# Altium project PCB_Project1.PrjPCB
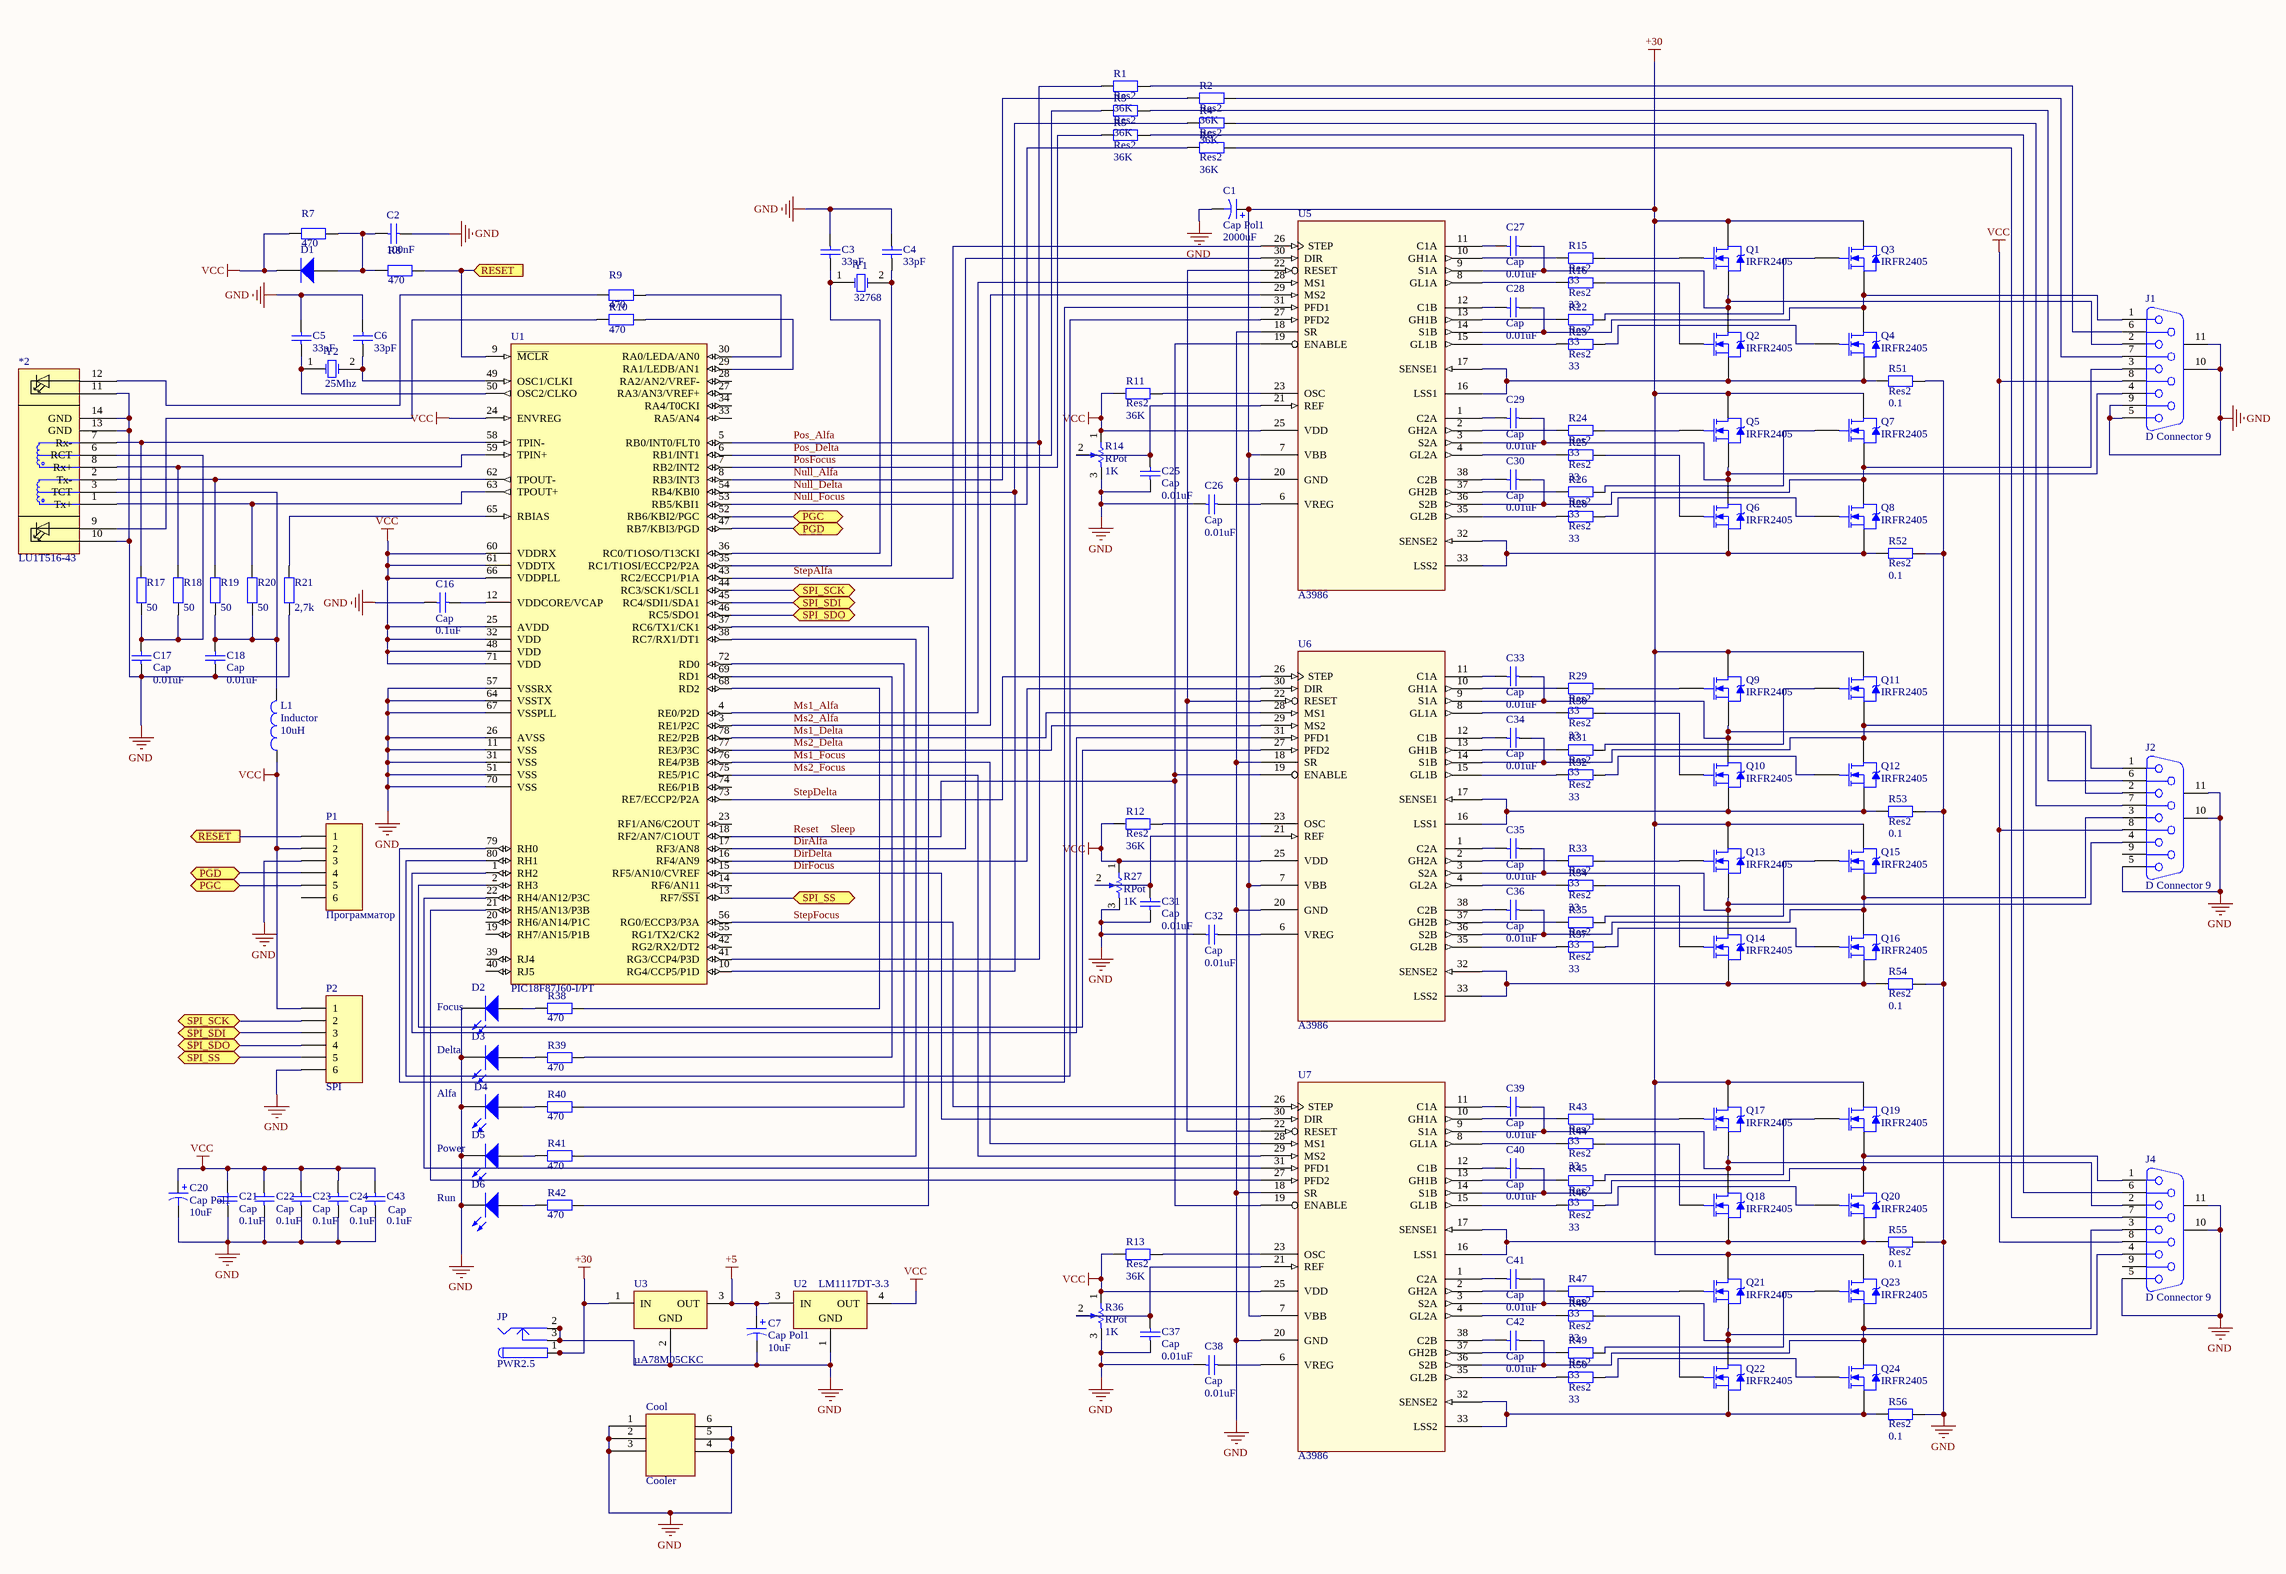
[diagram p0: Sheet1.SchDoc]
1 sheet, 137 parts. Net scope: flat (ports and power ports of the same name join across sheets).
Board file: PCB2.PcbDoc

## Sheet Sheet1.SchDoc
size A2

### Parts
*2  LU1T516-43  [EthernetCON]
C1  Cap Pol1  value 2000uF  [RB7.6-15]
C2  value 100nF  [CAPC3225N]  (hidden comment: Cap)
C3  value 33pF  [CAPC2012L]  (hidden comment: Cap)
C4  value 33pF  [CAPC2012L]  (hidden comment: Cap)
C5  value 33pF  [CAPC2012L]  (hidden comment: Cap)
C6  value 33pF  [CAPC2012L]  (hidden comment: Cap)
C7  Cap Pol1  value 10uF  [CAPPR5-5x5]
C16  Cap  value 0.1uF  [CAPC3225L]
C17  Cap  value 0.01uF  [CAPC3216L]
C18  Cap  value 0.01uF  [CAPC3216L]
C20  Cap Pol1  value 10uF  [CAPPR5-5x5]
C21  Cap  value 0.1uF  [CAPC3225L]
C22  Cap  value 0.1uF  [CAPC3225L]
C23  Cap  value 0.1uF  [CAPC3225L]
C24  Cap  value 0.1uF  [CAPC3225L]
C25  Cap  value 0.01uF  [CAPC2012L]
C26  Cap  value 0.01uF  [CAPC2012L]
C27  Cap  value 0.01uF  [CAPC2012L]
C28  Cap  value 0.01uF  [CAPC2012L]
C29  Cap  value 0.01uF  [CAPC2012L]
C30  Cap  value 0.01uF  [CAPC2012L]
C31  Cap  value 0.01uF  [CAPC2012L]
C32  Cap  value 0.01uF  [CAPC2012L]
C33  Cap  value 0.01uF  [CAPC2012L]
C34  Cap  value 0.01uF  [CAPC2012L]
C35  Cap  value 0.01uF  [CAPC2012L]
C36  Cap  value 0.01uF  [CAPC2012L]
C37  Cap  value 0.01uF  [CAPC2012L]
C38  Cap  value 0.01uF  [CAPC2012L]
C39  Cap  value 0.01uF  [CAPC2012L]
C40  Cap  value 0.01uF  [CAPC2012L]
C41  Cap  value 0.01uF  [CAPC2012L]
C42  Cap  value 0.01uF  [CAPC2012L]
C43  Cap  value 0.1uF  [CAPC3225L]
Cool  Cooler  [PCBComponent_1 - duplicate]
D1  Diode  [SOT95P240-3N]  (value not drawn)
D2  Power  [LED-1]
D3  Run  [LED-1]
D4  Alfa  [LED-1]
D5  Delta  [LED-1]
D6  Focus  [LED-1]
J1  D Connector 9  [D-SUB-9]
J2  D Connector 9  [D-SUB-9]
J4  D Connector 9  [D-SUB-9]
JP  PWR2.5  [KLD-0202]
L1  Inductor  value 10uH  [INDC3216AL]
P1  Программатор  [HDR1X6]
P2  SPI  [HDR1X6]
Q1  IRFR2405  [TO-252AA]
Q2  IRFR2405  [TO-252AA]
Q3  IRFR2405  [TO-252AA]
Q4  IRFR2405  [TO-252AA]
Q5  IRFR2405  [TO-252AA]
Q6  IRFR2405  [TO-252AA]
Q7  IRFR2405  [TO-252AA]
Q8  IRFR2405  [TO-252AA]
Q9  IRFR2405  [TO-252AA]
Q10  IRFR2405  [TO-252AA]
Q11  IRFR2405  [TO-252AA]
Q12  IRFR2405  [TO-252AA]
Q13  IRFR2405  [TO-252AA]
Q14  IRFR2405  [TO-252AA]
Q15  IRFR2405  [TO-252AA]
Q16  IRFR2405  [TO-252AA]
Q17  IRFR2405  [TO-252AA]
Q18  IRFR2405  [TO-252AA]
Q19  IRFR2405  [TO-252AA]
Q20  IRFR2405  [TO-252AA]
Q21  IRFR2405  [TO-252AA]
Q22  IRFR2405  [TO-252AA]
Q23  IRFR2405  [TO-252AA]
Q24  IRFR2405  [TO-252AA]
R1  Res2  value 36K  [RESC2012N]
R2  Res2  value 36K  [RESC2012N]
R3  Res2  value 36K  [RESC2012N]
R4  Res2  value 36K  [RESC2012N]
R5  Res2  value 36K  [RESC2012N]
R6  Res2  value 36K  [RESC2012N]
R7  value 470  [RESC2012M]  (hidden comment: Res2)
R8  value 470  [RESC2012M]  (hidden comment: Res2)
R9  value 470  [RESC2012M]  (hidden comment: Res2)
R10  value 470  [RESC2012M]  (hidden comment: Res2)
R11  Res2  value 36K  [RESC2012N]
R12  Res2  value 36K  [RESC2012N]
R13  Res2  value 36K  [RESC2012N]
R14  RPot  value 1K  [VR5]
R15  Res2  value 33  [RESC2012N]
R16  Res2  value 33  [RESC2012N]
R17  value 50  [RESC2012M]  (hidden comment: Res2)
R18  value 50  [RESC2012M]  (hidden comment: Res2)
R19  value 50  [RESC2012M]  (hidden comment: Res2)
R20  value 50  [RESC2012M]  (hidden comment: Res2)
R21  value 2,7k  [RESC2012M]  (hidden comment: Res2)
R22  Res2  value 33  [RESC2012N]
R23  Res2  value 33  [RESC2012N]
R24  Res2  value 33  [RESC2012N]
R25  Res2  value 33  [RESC2012N]
R26  Res2  value 33  [RESC2012N]
R27  RPot  value 1K  [VR5]
R28  Res2  value 33  [RESC2012N]
R29  Res2  value 33  [RESC2012N]
R30  Res2  value 33  [RESC2012N]
R31  Res2  value 33  [RESC2012N]
R32  Res2  value 33  [RESC2012N]
R33  Res2  value 33  [RESC2012N]
R34  Res2  value 33  [RESC2012N]
R35  Res2  value 33  [RESC2012N]
R36  RPot  value 1K  [VR5]
R37  Res2  value 33  [RESC2012N]
R38  value 470  [RESC2012M]  (hidden comment: Res2)
R39  value 470  [RESC2012M]  (hidden comment: Res2)
R40  value 470  [RESC2012M]  (hidden comment: Res2)
R41  value 470  [RESC2012M]  (hidden comment: Res2)
R42  value 470  [RESC2012M]  (hidden comment: Res2)
R43  Res2  value 33  [RESC2012N]
R44  Res2  value 33  [RESC2012N]
R45  Res2  value 33  [RESC2012N]
R46  Res2  value 33  [RESC2012N]
R47  Res2  value 33  [RESC2012N]
R48  Res2  value 33  [RESC2012N]
R49  Res2  value 33  [RESC2012N]
R50  Res2  value 33  [RESC2012N]
R51  Res2  value 0.1  [RESC6332L]
R52  Res2  value 0.1  [RESC6332L]
R53  Res2  value 0.1  [RESC6332L]
R54  Res2  value 0.1  [RESC6332L]
R55  Res2  value 0.1  [RESC6332L]
R56  Res2  value 0.1  [RESC6332L]
U1  PIC18F87J60-I/PT  [TQFP-PT80_N]
U2  LM1117DT-3.3  [TD03B_N]
U3  µA78M05CKC  [KC03]
U5  A3986  [TSSOP50P640-38AM]
U6  A3986  [TSSOP50P640-38AM]
U7  A3986  [TSSOP50P640-38AM]
Y1  value 32768  [Quartz]  (hidden comment: XTAL)
Y2  value 25Mhz  [Quartz]  (hidden comment: XTAL)

### Ports
PGC (bidir), PGD (bidir), RESET (in), RESET (out), SPI_SCK (bidir), SPI_SDI (bidir), SPI_SDO (bidir), SPI_SS (bidir)

### Nets
+5: C7.1 U2.3(IN) U3.3(OUT)
+30: C1.1 JP.1 JP.1A JP.1B Q1.4(D) Q3.4(D) Q5.4(D) Q7.4(D) Q9.4(D) Q11.4(D) Q13.4(D) Q15.4(D) Q17.4(D) Q19.4(D) Q21.4(D) Q23.4(D) U3.1(IN) U5.7(VBB) U6.7(VBB) U7.7(VBB)
GND: *2.10 *2.11 *2.13(GND) *2.14(GND) C1.2 C2.1 C3.2 C4.1 C5.2 C6.1 C7.2 C16.2 C17.1 C18.1 C20.2 C21.2 C22.2 C23.2 C24.2 C25.1 C26.2 C31.1 C32.2 C37.1 C38.2 C43.2 Cool.1 Cool.2 Cool.3 Cool.4 Cool.5 Cool.6 D2.2(K) D3.2(K) D4.2(K) D5.2(K) D6.2(K) J1.5 J1.9 J1.10(MH1) J1.11(MH2) J2.5 J2.10(MH1) J2.11(MH2) J4.5 J4.10(MH1) J4.11(MH2) JP.2 JP.2A JP.2B JP.3 JP.3A JP.3B P1.3 P2.6 R14.3(BOT) R21.1 R27.3(BOT) R36.3(BOT) R51.2 R52.2 R53.2 R54.2 R55.2 R56.2 U1.11(VSS) U1.26(AVSS) U1.31(VSS) U1.51(VSS) U1.57(VSSRX) U1.64(VSSTX) U1.67(VSSPLL) U1.70(VSS) U2.1(GND) U3.2(GND) U5.18(SR) U5.20(GND) U6.18(SR) U6.20(GND) U7.18(SR) U7.20(GND)
VCC: C20.1 C21.1 C22.1 C23.1 C24.1 C43.1 D1.2(K) J1.8 J2.8 J4.8 L1.1 P1.2 P2.1 R7.2 R11.2 R12.2 R13.2 R14.1(TOP) R27.1(TOP) R36.1(TOP) U1.24(ENVREG) U1.25(AVDD) U1.32(VDD) U1.48(VDD) U1.60(VDDRX) U1.61(VDDTX) U1.66(VDDPLL) U1.71(VDD) U2.4(OUT) U5.25(VDD) U6.25(VDD) U7.25(VDD)
DirAlfa: U1.17(RF3/AN8) U5.30(DIR)
DirDelta: U1.16(RF4/AN9) U6.30(DIR)
DirFocus: U1.15(RF5/AN10/CVREF) U7.30(DIR)
Ms1_Alfa: U1.4(RE0/P2D) U5.28(MS1)
Ms1_Delta: U1.78(RE2/P2B) U6.28(MS1)
Ms1_Focus: U1.76(RE4/P3B) U7.28(MS1)
Ms2_Alfa: U1.3(RE1/P2C) U5.29(MS2)
Ms2_Delta: U1.77(RE3/P3C) U6.29(MS2)
Ms2_Focus: U1.75(RE5/P1C) U7.29(MS2)
Null_Alfa: R2.2 U1.8(RB3/INT3)
Null_Delta: R4.2 U1.10(RG4/CCP5/P1D) U1.54(RB4/KBI0)
Null_Focus: R6.2 U1.53(RB5/KBI1)
Pos_Alfa: R1.2 U1.5(RB0/INT0/FLT0) U1.41(RG3/CCP4/P3D)
Pos_Delta: R3.2 U1.6(RB1/INT1)
PosFocus: R5.2 U1.7(RB2/INT2)
Reset: U1.18(RF2/AN7/C1OUT) U5.19(ENABLE) U6.19(ENABLE) U7.19(ENABLE)  [also labelled Sleep]
StepAlfa: U1.43(RC2/ECCP1/P1A) U5.26(STEP)
StepDelta: U1.73(RE7/ECCP2/P2A) U6.26(STEP)
StepFocus: U1.56(RG0/ECCP3/P3A) U7.26(STEP)
Net*2_1: *2.1(Tx+) R20.2 U1.63(TPOUT+)
Net*2_2: *2.2(Tx-) R19.2 U1.62(TPOUT-)
Net*2_3: *2.3(TCT) C18.2 L1.2 R19.1 R20.1
Net*2_6: *2.6(RCT) C17.2 R17.1 R18.1
Net*2_7: *2.7(Rx-) R17.2 U1.58(TPIN-)
Net*2_8: *2.8(Rx+) R18.2 U1.59(TPIN+)
Net*2_9: *2.9 R10.2
Net*2_12: *2.12 R9.2
NetC2_2: C2.2 D1.1(A) R7.1 R8.2
NetC3_1: C3.1 U1.36(RC0/T1OSO/T13CKI) Y1.1(OSC1)
NetC4_2: C4.2 U1.35(RC1/T1OSI/ECCP2/P2A) Y1.2(OSC2)
NetC5_1: C5.1 U1.50(OSC2/CLKO) Y2.1(OSC1)
NetC6_2: C6.2 U1.49(OSC1/CLKI) Y2.2(OSC2)
NetC16_1: C16.1 U1.12(VDDCORE/VCAP)
NetC25_2: C25.2 R14.2(TAP) U5.21(REF)
NetC26_1: C26.1 U5.6(VREG)
NetC27_1: C27.1 J1.2 Q1.3(S) Q2.4(D) U5.9(S1A)
NetC27_2: C27.2 U5.11(C1A)
NetC28_1: C28.1 J1.1 Q3.3(S) Q4.4(D) U5.14(S1B)
NetC28_2: C28.2 U5.12(C1B)
NetC29_1: C29.1 J1.4 Q5.3(S) Q6.4(D) U5.3(S2A)
NetC29_2: C29.2 U5.1(C2A)
NetC30_1: C30.1 J1.3 Q7.3(S) Q8.4(D) U5.36(S2B)
NetC30_2: C30.2 U5.38(C2B)
NetC31_2: C31.2 R27.2(TAP) U6.21(REF)
NetC32_1: C32.1 U6.6(VREG)
NetC33_1: C33.1 J2.2 Q9.3(S) Q10.4(D) U6.9(S1A)
NetC33_2: C33.2 U6.11(C1A)
NetC34_1: C34.1 J2.1 Q11.3(S) Q12.4(D) U6.14(S1B)
NetC34_2: C34.2 U6.12(C1B)
NetC35_1: C35.1 J2.4 Q13.3(S) Q14.4(D) U6.3(S2A)
NetC35_2: C35.2 U6.1(C2A)
NetC36_1: C36.1 J2.3 Q15.3(S) Q16.4(D) U6.36(S2B)
NetC36_2: C36.2 U6.38(C2B)
NetC37_2: C37.2 R36.2(TAP) U7.21(REF)
NetC38_1: C38.1 U7.6(VREG)
NetC39_1: C39.1 J4.2 Q17.3(S) Q18.4(D) U7.9(S1A)
NetC39_2: C39.2 U7.11(C1A)
NetC40_1: C40.1 J4.1 Q19.3(S) Q20.4(D) U7.14(S1B)
NetC40_2: C40.2 U7.12(C1B)
NetC41_1: C41.1 J4.4 Q21.3(S) Q22.4(D) U7.3(S2A)
NetC41_2: C41.2 U7.1(C2A)
NetC42_1: C42.1 J4.3 Q23.3(S) Q24.4(D) U7.36(S2B)
NetC42_2: C42.2 U7.38(C2B)
NetD2_1: D2.1(A) R38.2
NetD3_1: D3.1(A) R39.2
NetD4_1: D4.1(A) R40.2
NetD5_1: D5.1(A) R41.2
NetD6_1: D6.1(A) R42.2
NetJ1_6: J1.6 R1.1
NetJ1_7: J1.7 R2.1
NetJ2_6: J2.6 R3.1
NetJ2_7: J2.7 R4.1
NetJ4_6: J4.6 R5.1
NetJ4_7: J4.7 R6.1
NetP1_1: P1.1 R8.1 U1.9(~{MCLR}) ; port RESET
NetP1_4: P1.4 U1.47(RB7/KBI3/PGD) ; port PGD
NetP1_5: P1.5 U1.52(RB6/KBI2/PGC) ; port PGC
NetP2_2: P2.2 U1.44(RC3/SCK1/SCL1) ; port SPI_SCK
NetP2_3: P2.3 U1.45(RC4/SDI1/SDA1) ; port SPI_SDI
NetP2_4: P2.4 U1.46(RC5/SDO1) ; port SPI_SDO
NetP2_5: P2.5 U1.13(RF7/~{SS1}) ; port SPI_SS
NetQ1_1: Q1.1(G) R15.1
NetQ2_1: Q2.1(G) R16.1
NetQ2_3: Q2.3(S) Q4.3(S) R51.1 U5.16(LSS1) U5.17(SENSE1)
NetQ3_1: Q3.1(G) R22.1
NetQ4_1: Q4.1(G) R23.1
NetQ5_1: Q5.1(G) R24.1
NetQ6_1: Q6.1(G) R25.1
NetQ6_3: Q6.3(S) Q8.3(S) R52.1 U5.32(SENSE2) U5.33(LSS2)
NetQ7_1: Q7.1(G) R26.1
NetQ8_1: Q8.1(G) R28.1
NetQ9_1: Q9.1(G) R29.1
NetQ10_1: Q10.1(G) R30.1
NetQ10_3: Q10.3(S) Q12.3(S) R53.1 U6.16(LSS1) U6.17(SENSE1)
NetQ11_1: Q11.1(G) R31.1
NetQ12_1: Q12.1(G) R32.1
NetQ13_1: Q13.1(G) R33.1
NetQ14_1: Q14.1(G) R34.1
NetQ14_3: Q14.3(S) Q16.3(S) R54.1 U6.32(SENSE2) U6.33(LSS2)
NetQ15_1: Q15.1(G) R35.1
NetQ16_1: Q16.1(G) R37.1
NetQ17_1: Q17.1(G) R43.1
NetQ18_1: Q18.1(G) R44.1
NetQ18_3: Q18.3(S) Q20.3(S) R55.1 U7.16(LSS1) U7.17(SENSE1)
NetQ19_1: Q19.1(G) R45.1
NetQ20_1: Q20.1(G) R46.1
NetQ21_1: Q21.1(G) R47.1
NetQ22_1: Q22.1(G) R48.1
NetQ22_3: Q22.3(S) Q24.3(S) R56.1 U7.32(SENSE2) U7.33(LSS2)
NetQ23_1: Q23.1(G) R49.1
NetQ24_1: Q24.1(G) R50.1
NetR9_1: R9.1 U1.30(RA0/LEDA/AN0)
NetR10_1: R10.1 U1.29(RA1/LEDB/AN1)
NetR11_1: R11.1 U5.23(OSC)
NetR12_1: R12.1 U6.23(OSC)
NetR13_1: R13.1 U7.23(OSC)
NetR15_2: R15.2 U5.10(GH1A)
NetR16_2: R16.2 U5.8(GL1A)
NetR21_2: R21.2 U1.65(RBIAS)
NetR22_2: R22.2 U5.13(GH1B)
NetR23_2: R23.2 U5.15(GL1B)
NetR24_2: R24.2 U5.2(GH2A)
NetR25_2: R25.2 U5.4(GL2A)
NetR26_2: R26.2 U5.37(GH2B)
NetR28_2: R28.2 U5.35(GL2B)
NetR29_2: R29.2 U6.10(GH1A)
NetR30_2: R30.2 U6.8(GL1A)
NetR31_2: R31.2 U6.13(GH1B)
NetR32_2: R32.2 U6.15(GL1B)
NetR33_2: R33.2 U6.2(GH2A)
NetR34_2: R34.2 U6.4(GL2A)
NetR35_2: R35.2 U6.37(GH2B)
NetR37_2: R37.2 U6.35(GL2B)
NetR38_1: R38.1 U1.68(RD2)
NetR39_1: R39.1 U1.69(RD1)
NetR40_1: R40.1 U1.72(RD0)
NetR41_1: R41.1 U1.38(RC7/RX1/DT1)
NetR42_1: R42.1 U1.37(RC6/TX1/CK1)
NetR43_2: R43.2 U7.10(GH1A)
NetR44_2: R44.2 U7.8(GL1A)
NetR45_2: R45.2 U7.13(GH1B)
NetR46_2: R46.2 U7.15(GL1B)
NetR47_2: R47.2 U7.2(GH2A)
NetR48_2: R48.2 U7.4(GL2A)
NetR49_2: R49.2 U7.37(GH2B)
NetR50_2: R50.2 U7.35(GL2B)
NetU1_1: U1.1(RH2) U6.31(PFD1)
NetU1_2: U1.2(RH3) U6.27(PFD2)
NetU1_21: U1.21(RH5/AN13/P3B) U7.27(PFD2)
NetU1_22: U1.22(RH4/AN12/P3C) U7.31(PFD1)
NetU1_79: U1.79(RH0) U5.31(PFD1)
NetU1_80: U1.80(RH1) U5.27(PFD2)
NetU5_22: U5.22(RESET) U6.22(RESET) U7.22(RESET)

Not connected (* = marked no-connect by the designer): J2 9; J4 9; P1 6; U1 14(RF6/AN11) 19(RH7/AN15/P1B) 20(RH6/AN14/P1C) 23(RF1/AN6/C2OUT) 27(RA3/AN3/VREF+) 28(RA2/AN2/VREF-) 33(RA5/AN4) 34(RA4/T0CKI) 39(RJ4) 40(RJ5) 42(RG2/RX2/DT2) 55(RG1/TX2/CK2) 74(RE6/P1B)

### Library data of the parts
C1 C7 C20 = Cap Pol1: Polarized Capacitor (Radial); Published: 8-Jun-2000; LatestRevisionDate: 17-Jul-2002; LatestRevisionNote: Re-released for DXP Platform.; PackageReference: RB7.6-15; Publisher: Altium Limited
C2-C6 C16-C18 C21-C43 = Cap: Capacitor; Published: 8-Jun-2000; LatestRevisionDate: 17-Jul-2002; LatestRevisionNote: Re-released for DXP Platform.; PackageReference: RAD-0.3; Publisher: Altium Limited
D1 = Diode: Default Diode; Published: 8-Jun-2000; LatestRevisionDate: 17-Jul-2002; LatestRevisionNote: Re-released for DXP Platform.; PackageVersion: Sep-1996; PackageReference: SMC; Publisher: Altium Limited; Code_JEDEC: DO-214-AB
D2-D6 = LED1: Typical RED GaAs LED; Published: 8-Jun-2000; LatestRevisionDate: 08-Jul-2005; LatestRevisionNote: Mech Layer 1 removed.; PackageReference: LED-1; Publisher: Altium Limited
J1 J2 J4 = D Connector 9: Receptacle Assembly, 9 Position, Right Angle; PackageDocument: O; Positions: 9; Published: 15-Jun-2001; LatestRevisionDate: 17-Jul-2002; LatestRevisionNote: Re-released for DXP Platform.; DatasheetDocument: 1-Sep-1999; PackageReference: 788750; Publisher: Altium Limited; Orientation: Right Angle; Gender: Receptacle
JP = PWR2.5: Low Voltage Power Supply Connector; Published: 17-Dec-2003; DatasheetDocument: 09-May-2002; Publisher: Altium Limited; ComponentLink1Description: Manufacturer Link; ComponentLink1URL: http://domino.kycon.com/internet/Products.html
L1 = Inductor: Code_IEC: 1005; Published: 8-Jun-2000; LatestRevisionDate: 29-May-2009; LatestRevisionNote: IPC-7351 Footprint Added.; PackageReference: 0402-A; Publisher: Altium Limited; PackageDescription: Chip Inductor; Code_JEITA: 0402
P1 P2 = Header 6: Header, 6-Pin; LatestRevisionDate: 17-Jul-2002; LatestRevisionNote: Re-released for DXP Platform.; Publisher: Altium Limited
Q1-Q24 = IRFR2405: HEXFET Power MOSFET; Note: Pin 2 is trimmed and not drawn; Published: 17-Sep-2003; DatasheetVersion: Mar-2000; PackageVersion: Feb-2003; PackageReference: TO-252AA; Publisher: Altium Limited; PackageDescription: D-PAK/TO-252-AA; 3 Leads (1 Cropped); Body 10.4 (inc. leads) x 6.7 mm (LxW max); Code_JEDEC: TO-252-AA; ComponentLink1Description: Manufacturer Link; ComponentLink1URL: http://www.irf.com/; ComponentLink2Description: Datasheet; ComponentLink2URL: http://www.irf.com/product-info/datasheets/data/irfr2405.pdf
R1-R13 R15-R26 R28-R35 R37-R56 = Res2: Resistor; Published: 8-Jun-2000; LatestRevisionDate: 17-Jul-2002; LatestRevisionNote: Re-released for DXP Platform.; PackageReference: AXIAL-0.4; Publisher: Altium Limited
R14 R27 R36 = RPot: Potentiometer; Sim Note: Enter the Resistance value and the set point into parameter fields.; Set Position: 0.5; Published: 8-Jun-2000; LatestRevisionDate: 17-Jul-2002; LatestRevisionNote: Re-released for DXP Platform.; PackageReference: VR5; Publisher: Altium Limited
U1 = PIC18F87J60-I/PT: High Performance, 1-Mbit Flash Microcontroller with Ethernet, 128K Flash, 80-Pin TQFP, Industrial Temperature Range; Published: 29-Jan-2009; DatasheetVersion: revD, Feb-2008; PackageVersion: revAW, Oct-2008; PackageReference: TQFP-PT80; Publisher: Altium Limited; PackageDescription: 80-Lead Thin Plastic Quad Flat Pack (PT) - 12x12x1mm Body, 2.00mm [TQFP]; Code_JEDEC: MS-026; ComponentLink1Description: Manufacturer Link; ComponentLink1URL: http://www.microchip.com; ComponentLink2Description: Datasheet; ComponentLink2URL: http://ww1.microchip.com/downloads/en/DeviceDoc/39762d.pdf; ComponentLink3Description: Packaging Specification; ComponentLink3URL: http://ww1.microchip.com/downloads/en/PackagingSpec/00049AW.pdf
U2 = LM1117DT-3.3: 800mA Low-Dropout Linear Regulator; Manufacturer: National Semiconductor; CompType: LDO IC; PackageTopMarking: NSUZXYTT*LM1117*DT-3.3; PowerWise: N; Published: 4-Dec-2008; DatasheetVersion: Apr-2006; PackageVersion: revC, Apr-2003; PackageReference: TD03B; Publisher: Altium Limited; PackageDescription: TO252, Molded, Jedec, 6.8 x 6.10 x 2.30mm Body, 3 Lead, 2.28mm Pitch, Surface Mount; PartNumber: LM1117DT-3.3; RoHS: O; PinCount: 3; DigiKeyPartNumber: LM1117DT-3.3-ND; Code_JEDEC: TO-252-AA; ComponentLink1Description: LM1117 Datasheet; ComponentLink1URL: http://www.national.com/ds/LM/LM1117.pdf; ComponentLink2Description: LM1117 Web Page; ComponentLink2URL: http://www.national.com/pf/LM/LM1117.html; ComponentLink3Description: TD03B Package Page; ComponentLink3URL: http://www.national.com/packaging/folders/td03b.html
U3 = µA78M05CKC: Positive-Voltage Regulator; Note: Pin 2 is electrically connected to TAB.; Published: 15-Apr-2002; DatasheetVersion: Jul-1999; PackageVersion: Sep-1995; PackageReference: KC03; Publisher: Altium Limited; PackageDescription: TO, Thru-Hole, Vertical, Heatsink Mounted; 3 In-Line Leads; Pitch 2.54 mm; ComponentLink1Description: Manufacturer Link; ComponentLink1URL: http://www.ti.com/; ComponentLink2Description: Datasheet; ComponentLink2URL: http://www-s.ti.com/sc/ds/ua78m05.pdf
U5-U7 = A3986: Stepper Controller w External Full brige
Y1 Y2 = XTAL: Crystal Oscillator; Published: 8-Jun-2000; LatestRevisionDate: 17-Jul-2002; LatestRevisionNote: Re-released for DXP Platform.; PackageReference: R38; Publisher: Altium Limited